# EAGLE design HeadTracker (EAGLE 7.2.0)
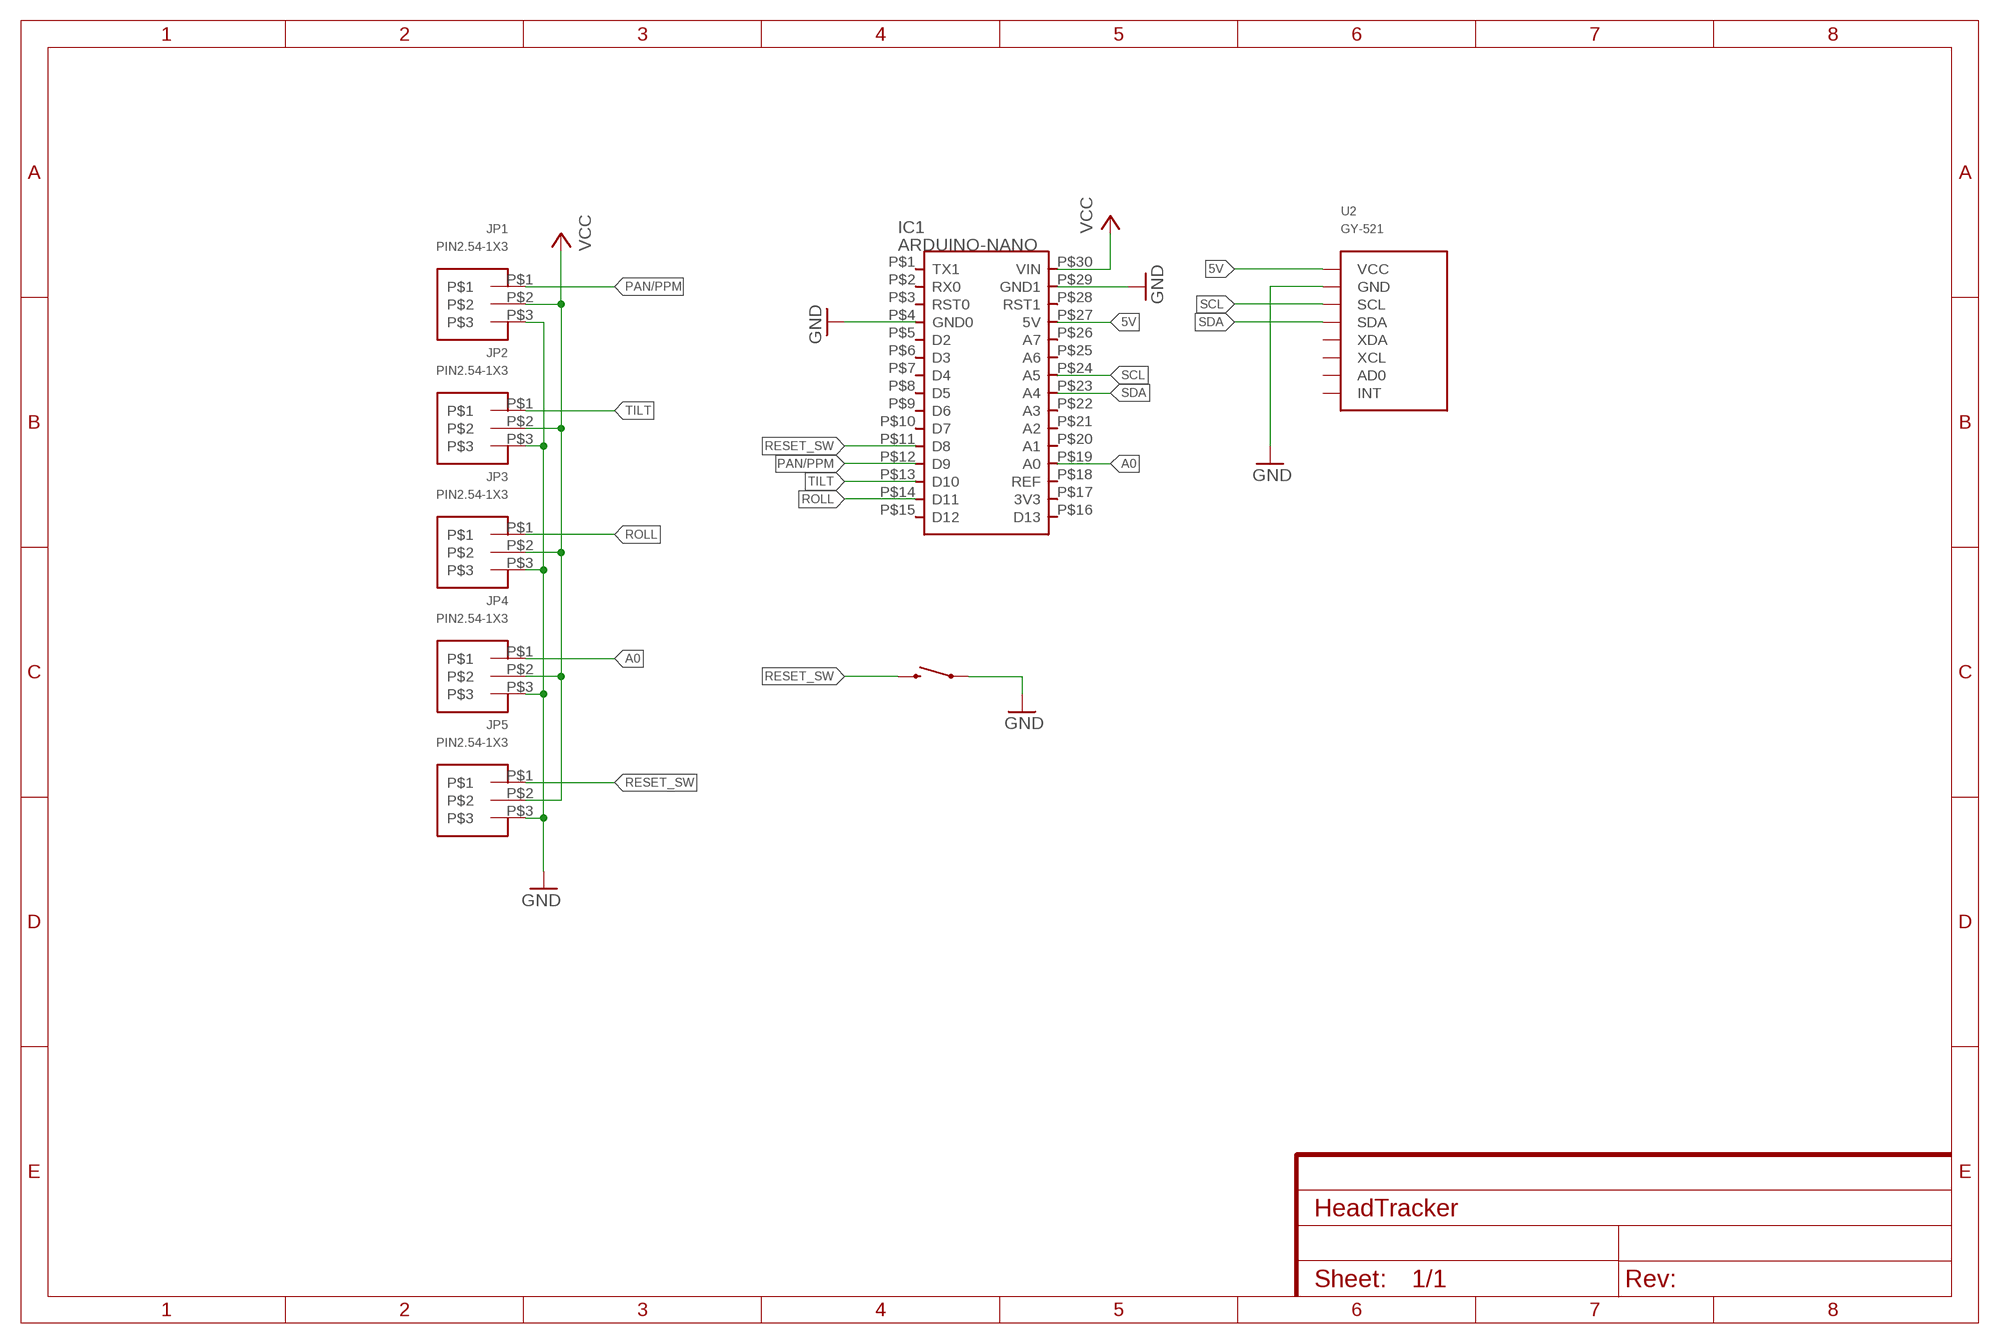
[diagram p0: schematic, sheet 1]

## Parts
IC1  ARDUINO-NANO  [ARDUINO-NANO]
JP1  PIN2.54-1X3  [PIN2.54-1X3]
JP2  PIN2.54-1X3  [PIN2.54-1X3]
JP3  PIN2.54-1X3  [PIN2.54-1X3]
JP4  PIN2.54-1X3  [PIN2.54-1X3]
JP5  PIN2.54-1X3  [PIN2.54-1X3]
S1  SWITCH-MOMENTARY-2PTH  [TACTILE-PTH]
U2  GY-521  [GY-521]

## Nets
5V: IC1.P$27(5V) U2.P$1(VCC)
A0: IC1.P$19(A0) JP4.P$1
GND: IC1.P$4(GND0) IC1.P$29(GND1) JP1.P$3 JP2.P$3 JP3.P$3 JP4.P$3 JP5.P$3 S1.1 U2.P$2(GND)
PAN/PPM: IC1.P$12(D9) JP1.P$1
RESET_SW: IC1.P$11(D8) JP5.P$1 S1.3
ROLL: IC1.P$14(D11) JP3.P$1
SCL: IC1.P$24(A5) U2.P$3(SCL)
SDA: IC1.P$23(A4) U2.P$4(SDA)
TILT: IC1.P$13(D10) JP2.P$1
VCC: IC1.P$30(VIN) JP1.P$2 JP2.P$2 JP3.P$2 JP4.P$2 JP5.P$2
Unconnected: IC1.P$1(TX1) IC1.P$2(RX0) IC1.P$3(RST0) IC1.P$5(D2) IC1.P$6(D3) IC1.P$7(D4) IC1.P$8(D5) IC1.P$9(D6) IC1.P$10(D7) IC1.P$15(D12) IC1.P$16(D13) IC1.P$17(3V3) IC1.P$18(REF) IC1.P$20(A1) IC1.P$21(A2) IC1.P$22(A3) IC1.P$25(A6) IC1.P$26(A7) IC1.P$28(RST1) U2.P$5(XDA) U2.P$6(XCL) U2.P$7(AD0) U2.P$8(INT)

## Library data of the parts
IC1 = Gimbal:ARDUINO-NANO
JP1-JP5 = Gimbal:PIN2.54-1X3
S1 = SparkFun-Electromechanical:SWITCH-MOMENTARY-2: Various NO switches- pushbuttons, reed, etc; PROD_ID: SWCH-08441
U2 = SmartSail:GY-521

## Board
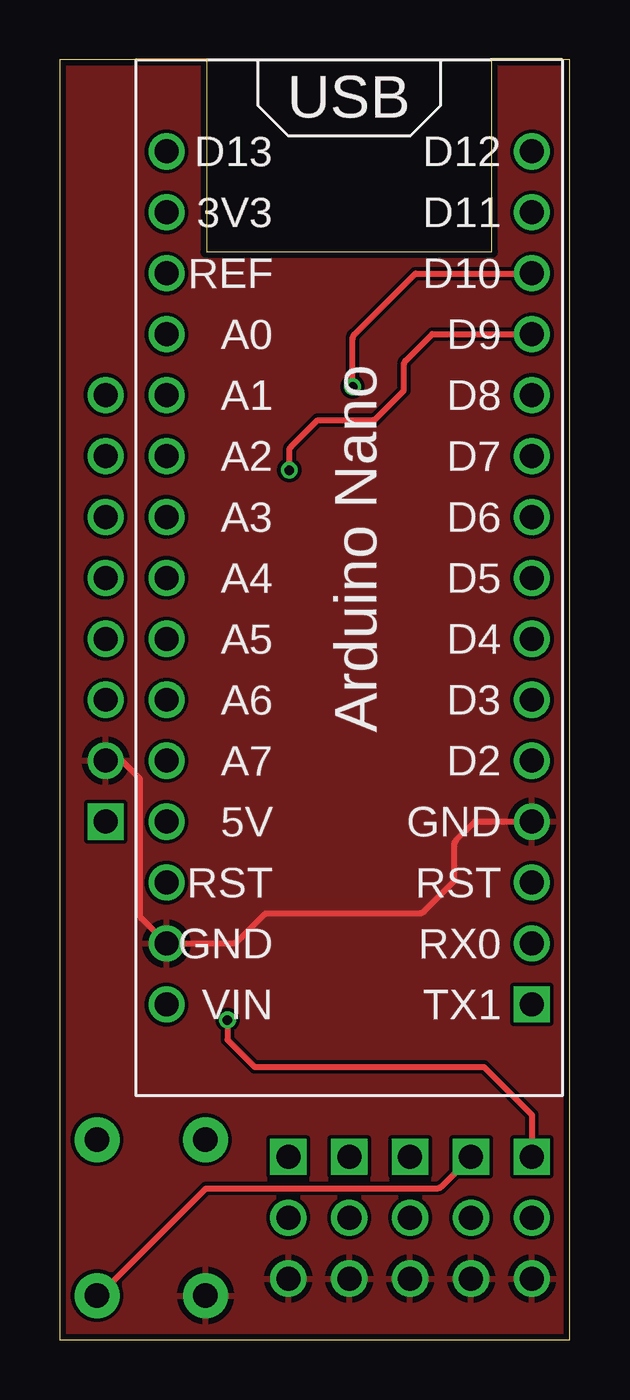
[diagram p1: board, top side]
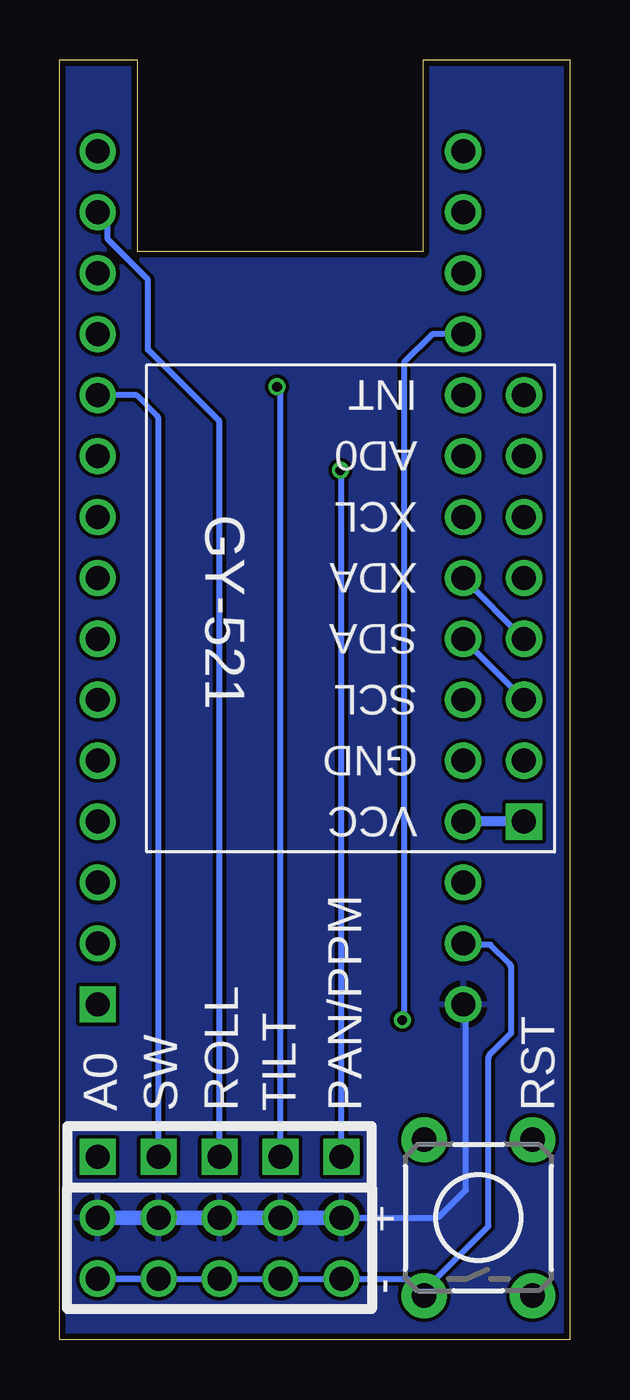
[diagram p2: board, bottom side, seen from below]

Size 21.26 x 53.34 mm. Coordinates in mm from the lower left corner, seen from the top.
Outline: 0,0 21.26,0 21.26,53.34 18.02,53.34 18.02,45.34 6.11,45.34 6.11,53.34 0,53.34 0,0
Copper layers (1*16): Top 0.035mm / dielectric 1.5mm / Bottom 0.035mm
Design rules "Elecrow_2-layer_eagle_rule": minimum track width 6mil, minimum drill 12mil, track to track 6mil, track to pad 6mil, pad to pad 6mil, via to via 6mil, smd to smd 0mil, copper to edge 10mil, drill to drill 10mil, minimum pad ring 10mil, minimum via ring 6mil, stop-mask expansion 2mil, vias tented up to drill 100mil, thermal gap 10mil

### Footprints (pad centres in the part's own frame; a part is rotated, then mirrored left to right if it is on the bottom)
ARDUINO-NANO = drill 1 square: P$1 -7.62,17.78 | drill 1: P$2 -7.62,15.24; P$3 -7.62,12.7; P$4 -7.62,10.16; P$5 -7.62,7.62; P$6 -7.62,5.08; P$7 -7.62,2.54; P$8 -7.62,0; P$9 -7.62,-2.54; P$10 -7.62,-5.08; P$11 -7.62,-7.62; P$12 -7.62,-10.16; P$13 -7.62,-12.7; P$14 -7.62,-15.24; P$15 -7.62,-17.78; P$16 7.62,-17.78; P$17 7.62,-15.24; P$18 7.62,-12.7; P$19 7.62,-10.16; P$20 7.62,-7.62; P$21 7.62,-5.08; P$22 7.62,-2.54; P$23 7.62,0; P$24 7.62,2.54; P$25 7.62,5.08; P$26 7.62,7.62; P$27 7.62,10.16; P$28 7.62,12.7; P$29 7.62,15.24; P$30 7.62,17.78
PIN2.54-1X3 = drill 1 square: P$1 0,2.54 | drill 1: P$2 0,0; P$3 0,-2.54
TACTILE-PTH = drill 1.016 pad 1.88: 1 -3.251,2.261; 2 3.251,2.261; 3 -3.251,-2.261; 4 3.251,-2.261
GY-521 = drill 1 square: P$1 0,8.89 | drill 1: P$2 0,6.35; P$3 0,3.81; P$4 0,1.27; P$5 0,-1.27; P$6 0,-3.81; P$7 0,-6.35; P$8 0,-8.89

### Placement (x,y rotation side)
IC1  12.07,31.75 180 top
JP1  9.52,5.08 0 bottom
JP2  12.07,5.08 0 bottom
JP3  14.61,5.08 0 bottom
JP4  19.69,5.08 0 bottom
JP5  17.15,5.08 0 bottom
S1  3.81,5.08 90 bottom
U2  1.91,30.48 180 bottom

### Tracks (layer width: path | path; a pad name or v marks a point on that pad's centre or on a via)
5V
  Bottom 0.406: U2.P$1 IC1.P$27
A0  (via drill 0.4)
  Top 0.254: v6.98,13.32 6.98,12.5 8.12,11.36 17.69,11.36 19.69,9.36 JP4.P$1
  Bottom 0.254: IC1.P$19 5.73,41.91 6.91,40.74 6.91,13.4 v6.98,13.32
GND
  Top 0.254: IC1.P$4 arc45 19.66,21.6 17.33,21.6 16.52,20.79 arc45 16.45,20.62 16.45,19.12 15.16,17.83 arc-45 14.98,17.76 8.57,17.76 7.39,16.58 arc-45 7.21,16.51 IC1.P$29 3.4,17.56 arc-45 3.32,17.73 3.32,23.38 2.65,24.06 arc45 2.47,24.13 U2.P$2
  Bottom 0.254: JP5.P$3 JP4.P$3 JP2.P$3 JP1.P$3 6.89,2.54 arc45 6.71,2.47 S1.1 6.07,1.93 arc45 6,2.11 3.39,4.72 3.39,11.73 arc45 3.31,11.91 2.45,12.78 2.45,15.49 arc-45 2.52,15.67 3.3,16.46 4.32,16.46 arc45 IC1.P$29
  pour Top: -1.26,55.96 24.73,55.96 arc-90 24.98,55.71 24.98,-2.58 -1.48,-2.58 arc-90 -1.73,-2.33 -1.73,56.08
PAN/PPM  (via drill 0.4)
  Top 0.254: v9.57,36.24 9.57,37.03 arc-45 9.64,37.21 10.75,38.32 13,38.32 arc45 13.18,38.39 14.34,39.56 14.34,40.63 arc-45 14.42,40.81 15.52,41.92 19.66,41.92 arc-45 IC1.P$12
  Bottom 0.254: JP1.P$1 9.52,36.14 arc-45 v9.57,36.24
RESET_SW
  Top 0.254: S1.3 arc45 1.66,1.87 6.09,6.3 15.72,6.3 arc45 15.9,6.37 JP5.P$1
  Bottom 0.254: JP5.P$1 17.15,38.34 arc-45 17.22,38.51 18.06,39.36 19.66,39.36 arc45 IC1.P$11
ROLL
  Bottom 0.254: JP3.P$1 14.61,38.28 17.59,41.26 17.59,44.18 19.27,45.86 19.27,46.57 IC1.P$14
SCL
  Bottom 0.254: U2.P$3 IC1.P$24
SDA
  Bottom 0.254: U2.P$4 IC1.P$23
TILT  (via drill 0.4)
  Top 0.254: v12.2,39.72 12.2,41.71 arc-45 12.28,41.89 14.82,44.44 19.66,44.44 arc45 IC1.P$13
  Bottom 0.254: JP2.P$1 12.07,39.48 arc-45 12.14,39.65 v12.2,39.72
VCC
  Bottom 0.254: JP1.P$2 5.59,5.08 arc-45 5.41,5.15 4.32,6.24 4.32,13.74 arc-45 4.4,13.92 IC1.P$30
  Bottom 0.61: JP1.P$2 JP2.P$2 JP4.P$2 JP5.P$2
  pour Bottom: -1.12,55 22.61,55 arc-90 22.87,54.75 22.87,-1.78 -1.32,-1.78 arc-90 -1.57,-1.53 -1.57,54.94

### Text on the board
bPlace: INT | AD0 | XCL | GY-521 | XDA | SDA | SCL | GND | VCC | RST | PAN/PPM | TILT | ROLL | SW | A0 | + | -